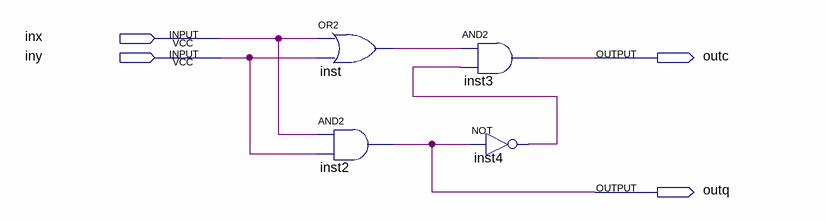
[diagram p0: schematic sheet]
// Quartus schematic SM1.bdf as structural Verilog: 4 symbols, 4 pins
module SM1 (
  input  inx,
  input  iny,
  output outc,
  output outq
);

  wire inst4_out, inst_out;

  or inst (inst_out, inx, iny);
  and inst2 (outq, inx, iny);
  and inst3 (outc, inst_out, inst4_out);
  not inst4 (inst4_out, outq);
endmodule
